# EAGLE design ZigBeeModule (EAGLE 7.6.0)
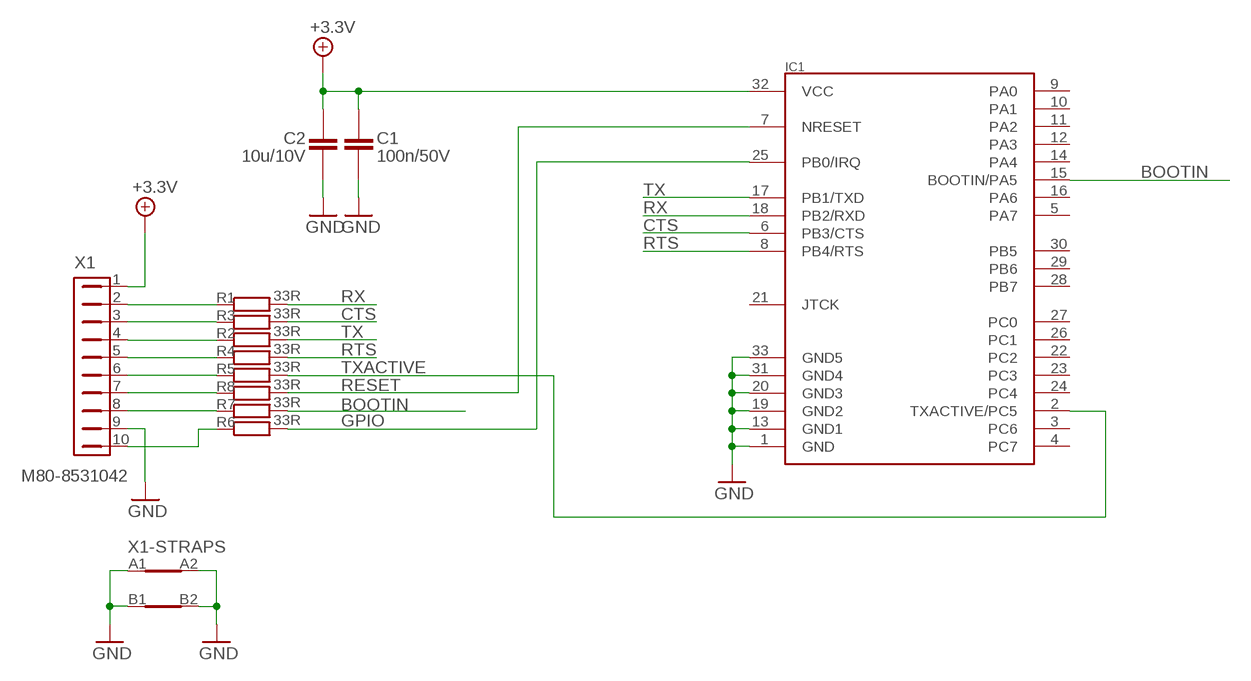
[diagram p0: schematic, sheet 1]

## Parts
C1  100N/50V,X7R,+/-10%_0603R  [C0603R]
C2  10U/10V,X5R,+/-20%_0603R  [C0603R]
IC1  ETRX357  [ETRX3]
R1  33R/0.1W,THICK_FILM,1%_0603R  [R0603R]
R2  33R/0.1W,THICK_FILM,1%_0603R  [R0603R]
R3  33R/0.1W,THICK_FILM,1%_0603R  [R0603R]
R4  33R/0.1W,THICK_FILM,1%_0603R  [R0603R]
R5  33R/0.1W,THICK_FILM,1%_0603R  [R0603R]
R6  33R/0.1W,THICK_FILM,1%_0603R  [R0603R]
R7  33R/0.1W,THICK_FILM,1%_0603R  [R0603R]
R8  33R/0.1W,THICK_FILM,1%_0603R  [R0603R]
X1  M80-8531042  M80-8531042-W_STRAPS  [M80-85310-W_STRAPS]

## Nets
+3.3V: C1.2 C2.2 IC1.32(VCC) X1.1
BOOTIN: IC1.15(BOOTIN/PA5) R7.2
CTS: IC1.6(PB3/CTS) R3.2
GND: C1.1 C2.1 IC1.1(GND) IC1.13(GND1) IC1.19(GND2) IC1.20(GND3) IC1.31(GND4) IC1.33(GND5) X1.9 X1.A1 X1.A2 X1.B1 X1.B2
GPIO: IC1.25(PB0/IRQ) R6.2
N$1: R6.1 X1.10
N$2: R1.1 X1.2
N$3: R3.1 X1.3
N$4: R2.1 X1.4
N$5: R4.1 X1.5
N$6: R5.1 X1.6
N$7: R7.1 X1.8
N$8: R8.1 X1.7
RESET: IC1.7(NRESET) R8.2
RTS: IC1.8(PB4/RTS) R4.2
RX: IC1.18(PB2/RXD) R1.2
TX: IC1.17(PB1/TXD) R2.2
TXACTIVE: IC1.2(TXACTIVE/PC5) R5.2
Unconnected: IC1.3(PC6) IC1.4(PC7) IC1.5(PA7) IC1.9(PA0) IC1.10(PA1) IC1.11(PA2) IC1.12(PA3) IC1.14(PA4) IC1.16(PA6) IC1.21(JTCK) IC1.22(PC2) IC1.23(PC3) IC1.24(PC4) IC1.26(PC1) IC1.27(PC0) IC1.28(PB7) IC1.29(PB6) IC1.30(PB5)

## Library data of the parts
C1 = 0-LIB_Capacitor_ceramic:100N; COMPONENT_PACKAGE: 0603; COMPONENT_TITLE: Capacitor ceramic; COMPONENT_VALUE: 100n/50V; LIB: ECAP-000019; LIB_REEL: ECAP-000129; NOTE: X7R, +/-10%
C2 = 0-LIB_Capacitor_ceramic:10U; COMPONENT_PACKAGE: 0603; COMPONENT_TITLE: Capacitor ceramic; COMPONENT_VALUE: 10u/10V; LIB: ECAP-000022; LIB_REEL: ECAP-000130; NOTE: X5R, +/-20%
IC1 = telegesis:ETRX357
R1-R8 = 0-LIB_Resistor:33R; COMPONENT_PACKAGE: 0603; COMPONENT_TITLE: Resistor; COMPONENT_VALUE: 33R; LIB: ERES-000051; LIB_REEL: ERES-000196; NOTE: 0.1W, Thick_Film, 1%
X1 = 0-LIB_Connectors_Wire-To-Board_HARWIN:M80-?1042-W_STRAPS; COMPONENT_MANUFACTURER: HARWIN; COMPONENT_PACKAGE: 2mm, 2x5pins; COMPONENT_TITLE: Connector; COMPONENT_VALUE: M80-8531042; FARNELL: 1463000; LIB: ECON-000023; NOTE: Through Hole, Vertical

## Board
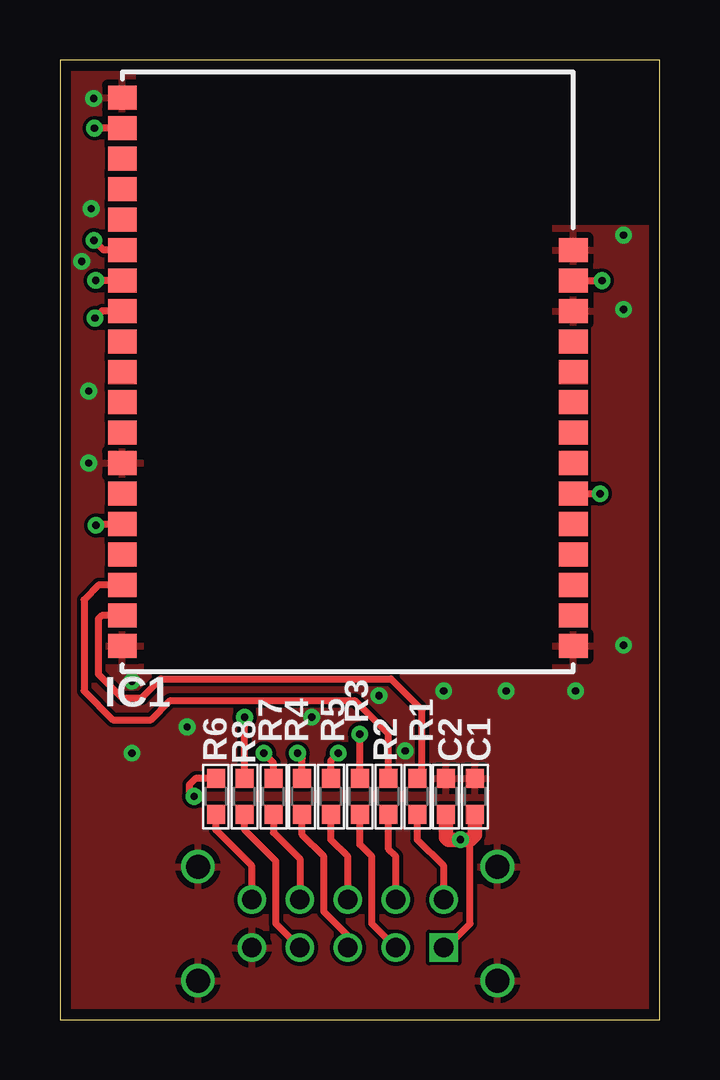
[diagram p1: board, top side]
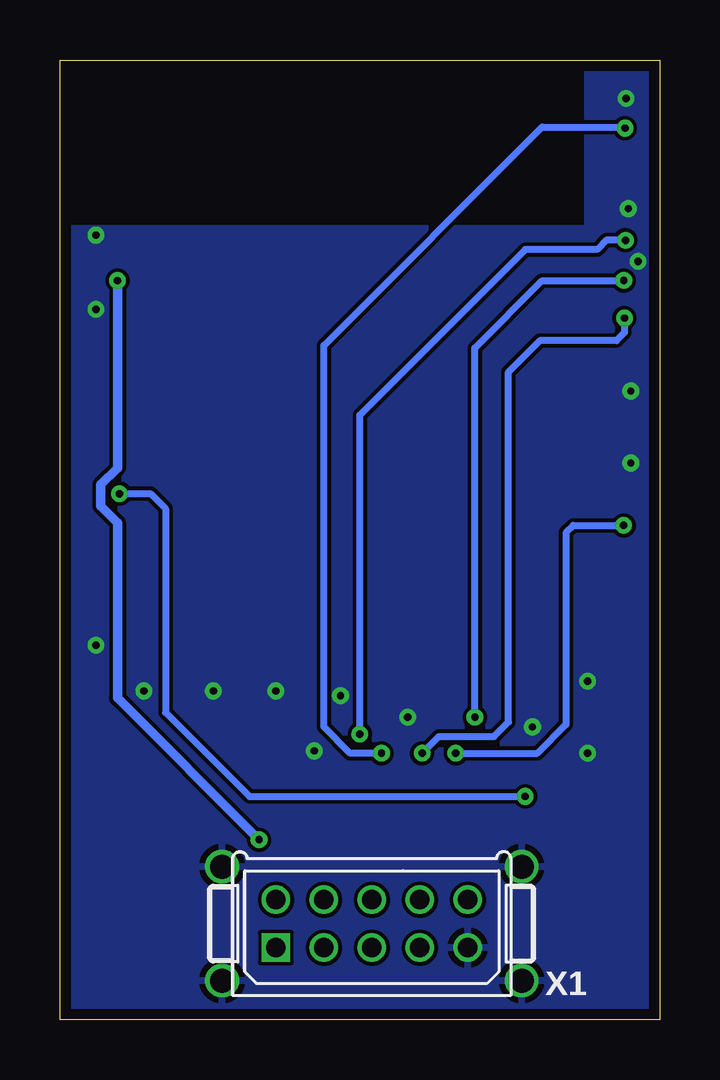
[diagram p2: board, bottom side, seen from below]

Size 25 x 40 mm. Coordinates in mm from the lower left corner, seen from the top.
Outline: 0,0 25,0 25,40 0,40 0,0
Copper layers (1+2*15+16): Top 0.018mm / dielectric 0.25mm / Route2 0.018mm / dielectric 0.4mm / Route15 0.018mm / dielectric 0.25mm / Bottom 0.018mm
Design rules "KC6benesov *": minimum track width 0.15mm, minimum drill 0.3mm, track to track 0.15mm, track to pad 0.15mm, pad to pad 0.15mm, via to via 0.15mm, smd to smd 0.15mm, copper to edge 0.45mm, drill to drill 0.3mm, minimum pad ring 0.2mm, minimum via ring 0.2mm, stop-mask expansion 0mil, vias tented up to drill 0.4mm, thermal gap 10mil
tRestrict: area 3.5,14.5 to 20.5,39

### Footprints (pad centres in the part's own frame; a part is rotated, then mirrored left to right if it is on the bottom)
C0603R = smd 0.8 x 0.75: 1 -0.75,0; 2 0.75,0
ETRX3 = smd 1.2 x 1: 1 -9.4,11.43; 2 -9.4,10.16; 3 -9.4,8.89; 4 -9.4,7.62; 5 -9.4,6.35; 6 -9.4,5.08; 7 -9.4,3.81; 8 -9.4,2.54; 9 -9.4,1.27; 10 -9.4,0; 11 -9.4,-1.27; 12 -9.4,-2.54; 13 -9.4,-3.81; 14 -9.4,-5.08; 15 -9.4,-6.35; 16 -9.4,-7.62; 17 -9.4,-8.89; 18 -9.4,-10.16; 19 -9.4,-11.43; 20 9.4,-11.43; 21 9.4,-10.16; 22 9.4,-8.89; 23 9.4,-7.62; 24 9.4,-6.35; 25 9.4,-5.08; 26 9.4,-3.81; 27 9.4,-2.54; 28 9.4,-1.27; 29 9.4,0; 30 9.4,1.27; 31 9.4,2.54; 32 9.4,3.81; 33 9.4,5.08
R0603R = smd 0.8 x 0.75: 1 -0.75,0; 2 0.75,0
M80-85310-W_STRAPS = drill 0.8 square: 1 4,1 | drill 0.8: 2 4,-1; 3 2,1; 4 2,-1; 5 0,1; 6 0,-1; 7 -2,1; 8 -2,-1; 9 -4,1; 10 -4,-1 | drill 1: A1 6.24,2.375; A2 6.24,-2.375; B1 -6.25,2.375; B2 -6.25,-2.375

### Placement (x,y rotation side)
C1  17.3,9.3 270 top
C2  16.1,9.3 270 top
IC1  12,27 0 top
R1  14.9,9.3 90 top
R2  13.7,9.3 90 top
R3  12.5,9.3 90 top
R4  10.1,9.3 90 top
R5  11.3,9.3 90 top
R6  6.5,9.3 90 top
R7  8.9,9.3 90 top
R8  7.7,9.3 90 top
X1  12,4 180 bottom

### Tracks (layer width: path | path; a pad name or v marks a point on that pad's centre or on a via)
+3.3V  (via drill 0.3)
  Top 0.3: X1.1 16.1,3 17.1,4 17.1,7.5 | IC1.32 v22.59,30.81 v22.6,30.8
  Top 0.6: C2.2 16.1,7.6 16.2,7.5 v16.7,7.5 17.1,7.5 17.3,7.7 C1.2
  Bottom 0.4: v22.6,30.8 22.6,23 23.3,22.3 23.3,21.4 22.6,20.7 22.6,13.4 v16.7,7.5
BOOTIN  (via drill 0.3)
  Top 0.3: v1.5,20.6 1.55,20.65 IC1.15 | R7.2 8.9,10.7 v8.5,11.1
  Bottom 0.3: v1.5,20.6 3.6,20.6 3.9,20.3 3.9,12.3 5.1,11.1 v8.5,11.1
CTS  (via drill 0.3)
  Top 0.3: R3.2 v12.5,11.9 | IC1.6 1.82,32.08 v1.42,32.48
  Bottom 0.3: v12.5,11.9 12.5,25.2 5.6,32.1 2.6,32.1 2.22,32.48 v1.42,32.48
GND  (via drill 0.3)
  other vias: 13.3,13.5 10.5,12.6 16,13.7 18.6,13.7 23.5,15.6 23.5,29.6 23.5,32.7 1.4,38.4 1.2,23.2 3,14.1 21.5,13.7 14.4,11.2 3,11.1 1.2,26.2 5.3,12.2 1.3,33.8 0.9,31.6
  pour Top: 0,0 0,40 3,40 3,33 25,33 25,0
  pour Bottom: 0,0 25,0 25,33 3,33 3,40 0,40
GPIO  (via drill 0.3)
  Top 0.3: IC1.25 v22.52,21.92 | R6.2 5.65,10.05 5.4,9.8 5.4,9.5 v5.6,9.3
  Bottom 0.3: v5.6,9.3 17.1,9.3 20.6,12.8 20.6,21.3 21.22,21.92 v22.52,21.92
N$1
  Top 0.3: X1.10 8,6.4 6.5,7.9 R6.1
N$2
  Top 0.3: X1.2 16,6.4 14.9,7.5 R1.1
N$3
  Top 0.3: X1.3 13,4 13,6.8 12.5,7.3 R3.1
N$4
  Top 0.3: X1.4 14,6.8 13.7,7.1 R2.1
N$5
  Top 0.3: X1.5 12,3.5 11,4.5 11,6.8 10.1,7.7 R4.1
N$6
  Top 0.3: X1.6 12,6.8 11.3,7.5 R5.1
N$7
  Top 0.3: R7.1 8.9,7.8 10,6.7 X1.8
N$8
  Top 0.3: X1.7 9,4 9,6.6 7.7,7.9 R8.1
RESET  (via drill 0.3)
  Top 0.3: IC1.7 v1.49,30.81 | R8.2 v7.7,12.6
  Bottom 0.3: v7.7,12.6 7.7,28 4.9,30.8 v1.5,30.8 v1.49,30.81
RTS  (via drill 0.3)
  Top 0.3: IC1.8 1.76,29.54 v1.46,29.24 | R4.2 10.1,10.9 v9.9,11.1
  Bottom 0.3: v1.46,29.24 1.46,28.64 1.8,28.3 5,28.3 6.3,27 6.3,12.4 6.9,11.8 9.2,11.8 v9.9,11.1
RX
  Top 0.3: IC1.18 1.74,16.84 1.6,16.7 1.6,14.4 2.6,13.4 3.4,13.4 4.2,14.2 13.8,14.2 15.1,12.9 15.1,10.25 R1.2
TX
  Top 0.3: IC1.17 1.61,18.11 1,17.5 1,13.7 2.2,12.5 3.8,12.5 4.6,13.3 12.3,13.3 13.7,11.9 R2.2
TXACTIVE  (via drill 0.3)
  Top 0.3: IC1.2 v1.44,37.16 | R5.2 11.3,10.8 v11.6,11.1
  Bottom 0.3: v1.44,37.16 1.48,37.2 4.9,37.2 14,28.1 14,12.2 12.9,11.1 v11.6,11.1